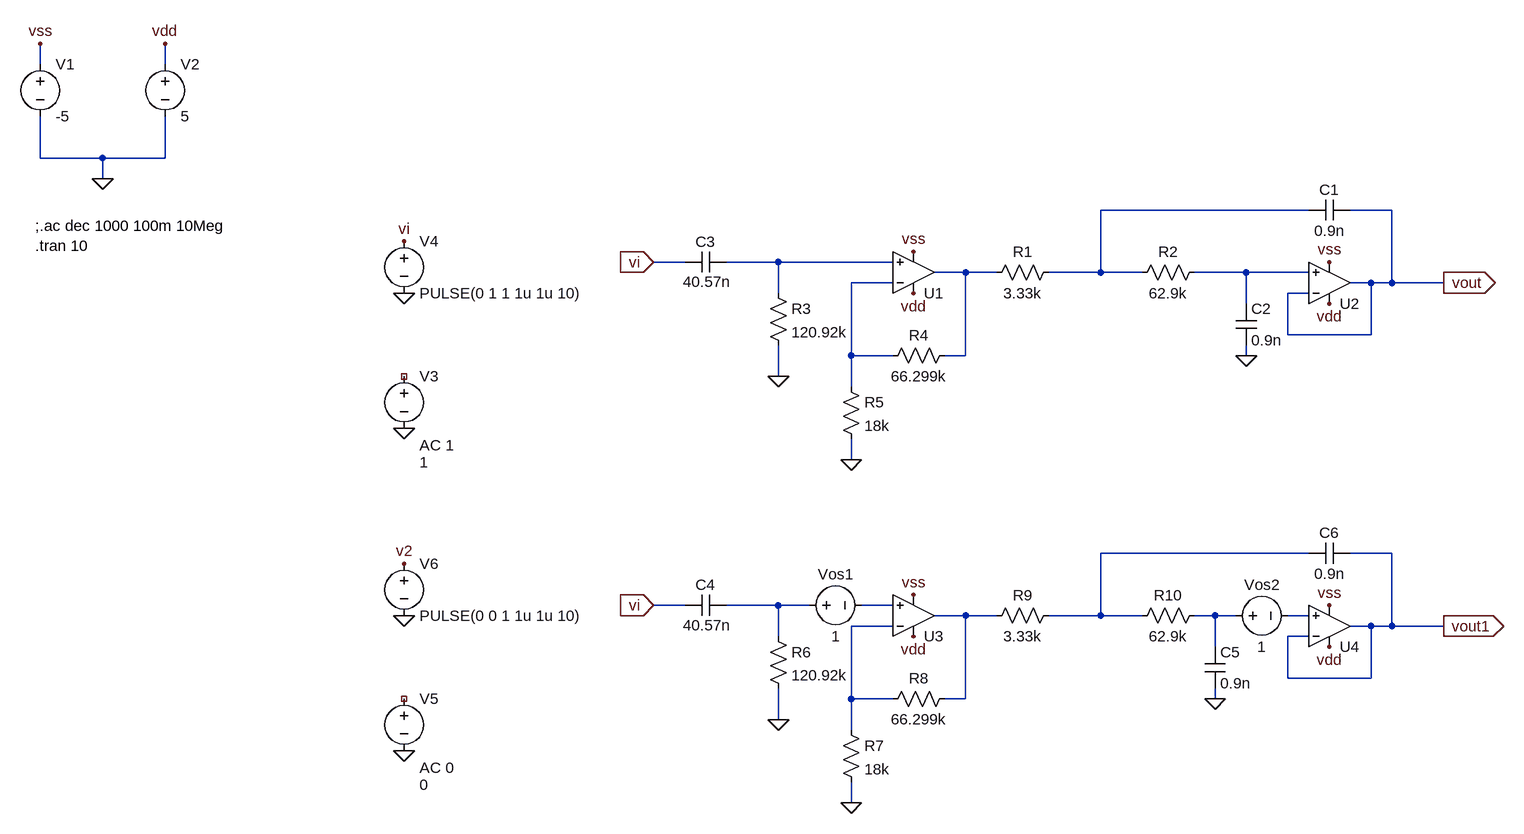
[diagram p0: schematic Draft2.asc]
Draft2.asc, the LTspice schematic file:
Version 4
SHEET 1 1324 1264
WIRE -944 -192 -944 -224
WIRE -752 -192 -752 -224
WIRE -944 -48 -944 -112
WIRE -848 -48 -944 -48
WIRE -752 -48 -752 -112
WIRE -752 -48 -848 -48
WIRE -848 -16 -848 -48
WIRE 1008 32 688 32
WIRE 1136 32 1072 32
WIRE 48 112 0 112
WIRE 192 112 112 112
WIRE 368 112 192 112
WIRE 480 128 432 128
WIRE 528 128 480 128
WIRE 688 128 688 32
WIRE 688 128 608 128
WIRE 752 128 688 128
WIRE 912 128 832 128
WIRE 1008 128 912 128
WIRE 368 144 304 144
WIRE 1104 144 1072 144
WIRE 1136 144 1136 32
WIRE 1136 144 1104 144
WIRE 1216 144 1136 144
WIRE 192 160 192 112
WIRE 1008 160 976 160
WIRE 912 176 912 128
WIRE 976 224 976 160
WIRE 1104 224 1104 144
WIRE 1104 224 976 224
WIRE 304 256 304 144
WIRE 368 256 304 256
WIRE 480 256 480 128
WIRE 480 256 448 256
WIRE 912 256 912 240
WIRE 192 288 192 240
WIRE 304 304 304 256
WIRE 304 416 304 384
WIRE 1008 560 688 560
WIRE 1136 560 1072 560
WIRE 48 640 0 640
WIRE 192 640 112 640
WIRE 240 640 192 640
WIRE 368 640 320 640
WIRE 480 656 432 656
WIRE 528 656 480 656
WIRE 688 656 688 560
WIRE 688 656 608 656
WIRE 752 656 688 656
WIRE 864 656 832 656
WIRE 896 656 864 656
WIRE 1008 656 976 656
WIRE 368 672 304 672
WIRE 1104 672 1072 672
WIRE 1136 672 1136 560
WIRE 1136 672 1104 672
WIRE 1216 672 1136 672
WIRE 192 688 192 640
WIRE 1008 688 976 688
WIRE 864 704 864 656
WIRE 976 752 976 688
WIRE 1104 752 1104 672
WIRE 1104 752 976 752
WIRE 304 784 304 672
WIRE 368 784 304 784
WIRE 480 784 480 656
WIRE 480 784 448 784
WIRE 864 784 864 768
WIRE 192 816 192 768
WIRE 304 832 304 784
WIRE 304 944 304 912
FLAG 912 256 0
FLAG 304 416 0
FLAG 192 288 0
FLAG 0 112 vi
IOPIN 0 112 In
FLAG 1216 144 vout
IOPIN 1216 144 Out
FLAG 400 96 vss
FLAG 1040 112 vss
FLAG 400 160 vdd
FLAG 1040 176 vdd
FLAG -944 -224 vss
FLAG -752 -224 vdd
FLAG -848 -16 0
FLAG -384 80 vi
FLAG -384 368 0
FLAG -384 160 0
FLAG 864 784 0
FLAG 304 944 0
FLAG 192 816 0
FLAG 0 640 vi
IOPIN 0 640 In
FLAG 1216 672 vout1
IOPIN 1216 672 Out
FLAG 400 624 vss
FLAG 1040 640 vss
FLAG 400 688 vdd
FLAG 1040 704 vdd
FLAG -384 576 v2
FLAG -384 864 0
FLAG -384 656 0
SYMBOL cap 112 96 R90
WINDOW 0 0 32 VBottom 2
WINDOW 3 62 30 VBottom 2
SYMATTR InstName C3
SYMATTR Value 40.57n
SYMBOL res 176 144 R0
SYMATTR InstName R3
SYMATTR Value 120.92k
SYMBOL OpAmps\\UniversalOpAmp2 400 128 M180
SYMATTR InstName U1
SYMBOL res 288 288 R0
SYMATTR InstName R5
SYMATTR Value 18k
SYMBOL res 464 240 R90
WINDOW 0 0 56 VBottom 2
WINDOW 3 32 56 VTop 2
SYMATTR InstName R4
SYMATTR Value 66.299k
SYMBOL res 624 112 R90
WINDOW 0 0 56 VBottom 2
WINDOW 3 32 56 VTop 2
SYMATTR InstName R1
SYMATTR Value 3.33k
SYMBOL res 848 112 R90
WINDOW 0 0 56 VBottom 2
WINDOW 3 32 56 VTop 2
SYMATTR InstName R2
SYMATTR Value 62.9k
SYMBOL cap 896 176 R0
SYMATTR InstName C2
SYMATTR Value 0.9n
SYMBOL cap 1072 16 R90
WINDOW 0 0 32 VBottom 2
WINDOW 3 32 32 VTop 2
SYMATTR InstName C1
SYMATTR Value 0.9n
SYMBOL OpAmps\\UniversalOpAmp2 1040 144 M180
SYMATTR InstName U2
SYMBOL voltage -944 -208 R0
SYMATTR InstName V1
SYMATTR Value -5
SYMBOL voltage -752 -208 R0
SYMATTR InstName V2
SYMATTR Value 5
SYMBOL voltage -384 272 R0
WINDOW 3 24 148 Left 2
WINDOW 123 24 122 Left 2
WINDOW 39 0 0 Left 0
SYMATTR Value 1
SYMATTR Value2 AC 1
SYMATTR InstName V3
SYMBOL voltage -384 64 R0
WINDOW 123 24 122 Left 2
WINDOW 39 0 0 Left 0
SYMATTR InstName V4
SYMATTR Value PULSE(0 1 1 1u 1u 10)
SYMBOL cap 112 624 R90
WINDOW 0 0 32 VBottom 2
WINDOW 3 62 30 VBottom 2
SYMATTR InstName C4
SYMATTR Value 40.57n
SYMBOL res 176 672 R0
SYMATTR InstName R6
SYMATTR Value 120.92k
SYMBOL OpAmps\\UniversalOpAmp2 400 656 M180
SYMATTR InstName U3
SYMBOL res 288 816 R0
SYMATTR InstName R7
SYMATTR Value 18k
SYMBOL res 464 768 R90
WINDOW 0 0 56 VBottom 2
WINDOW 3 32 56 VTop 2
SYMATTR InstName R8
SYMATTR Value 66.299k
SYMBOL res 624 640 R90
WINDOW 0 0 56 VBottom 2
WINDOW 3 32 56 VTop 2
SYMATTR InstName R9
SYMATTR Value 3.33k
SYMBOL res 848 640 R90
WINDOW 0 0 56 VBottom 2
WINDOW 3 32 56 VTop 2
SYMATTR InstName R10
SYMATTR Value 62.9k
SYMBOL cap 848 704 R0
SYMATTR InstName C5
SYMATTR Value 0.9n
SYMBOL cap 1072 544 R90
WINDOW 0 0 32 VBottom 2
WINDOW 3 32 32 VTop 2
SYMATTR InstName C6
SYMATTR Value 0.9n
SYMBOL OpAmps\\UniversalOpAmp2 1040 672 M180
SYMATTR InstName U4
SYMBOL voltage -384 768 R0
WINDOW 3 24 148 Left 2
WINDOW 123 24 122 Left 2
WINDOW 39 0 0 Left 0
SYMATTR Value 0
SYMATTR Value2 AC 0
SYMATTR InstName V5
SYMBOL voltage -384 560 R0
WINDOW 123 24 122 Left 2
WINDOW 39 0 0 Left 0
SYMATTR InstName V6
SYMATTR Value PULSE(0 0 1 1u 1u 10)
SYMBOL voltage 880 656 R270
WINDOW 0 32 56 VTop 2
WINDOW 3 -32 56 VBottom 2
WINDOW 123 0 0 Left 0
WINDOW 39 0 0 Left 0
SYMATTR InstName Vos2
SYMATTR Value 1
SYMBOL voltage 224 640 R270
WINDOW 0 32 56 VTop 2
WINDOW 3 -32 56 VBottom 2
WINDOW 123 0 0 Left 0
WINDOW 39 0 0 Left 0
SYMATTR InstName Vos1
SYMATTR Value 1
TEXT -952 56 Left 2 !;.ac dec 1000 100m 10Meg\n.tran 10

The netlist it stands for:
* Draft2.asc
C3 N002 vi 40.57n
R3 N002 0 120.92k
XU1 N002 N005 vdd vss N003 level2 Avol=1Meg GBW=10Meg Slew=10Meg Ilimit=25m Rail=0 Vos=0 En=0 Enk=0 In=0 Ink=0 Rin=500Meg  ; pins In+ In- V+ V- OUT
R5 N005 0 18k
R4 N003 N005 66.299k
R1 N001 N003 3.33k
R2 N004 N001 62.9k
C2 N004 0 0.9n
C1 vout N001 0.9n
XU2 N004 vout vdd vss vout level2 Avol=1Meg GBW=10Meg Slew=10Meg Ilimit=25m Rail=0 Vos=0 En=0 Enk=0 In=0 Ink=0 Rin=500Meg  ; pins In+ In- V+ V- OUT
V1 vss 0 -5
V2 vdd 0 5
V3 NC_01 0 1 AC 1
V4 vi 0 PULSE(0 1 1 1u 1u 10)
C4 N007 vi 40.57n
R6 N007 0 120.92k
XU3 N008 N012 vdd vss N009 level2 Avol=1Meg GBW=10Meg Slew=10Meg Ilimit=25m Rail=0 Vos=0 En=0 Enk=0 In=0 Ink=0 Rin=500Meg  ; pins In+ In- V+ V- OUT
R7 N012 0 18k
R8 N009 N012 66.299k
R9 N006 N009 3.33k
R10 N010 N006 62.9k
C5 N010 0 0.9n
C6 vout1 N006 0.9n
XU4 N011 vout1 vdd vss vout1 level2 Avol=1Meg GBW=10Meg Slew=10Meg Ilimit=25m Rail=0 Vos=0 En=0 Enk=0 In=0 Ink=0 Rin=500Meg  ; pins In+ In- V+ V- OUT
V5 NC_02 0 0 AC 0
V6 v2 0 PULSE(0 0 1 1u 1u 10)
Vos2 N010 N011 1
Vos1 N007 N008 1
;.ac dec 1000 100m 10Meg
.tran 10
.lib UniversalOpAmp2.lib
.backanno
.end